# EAGLE design HIVDC_v1p1 (EAGLE 9.6.2)
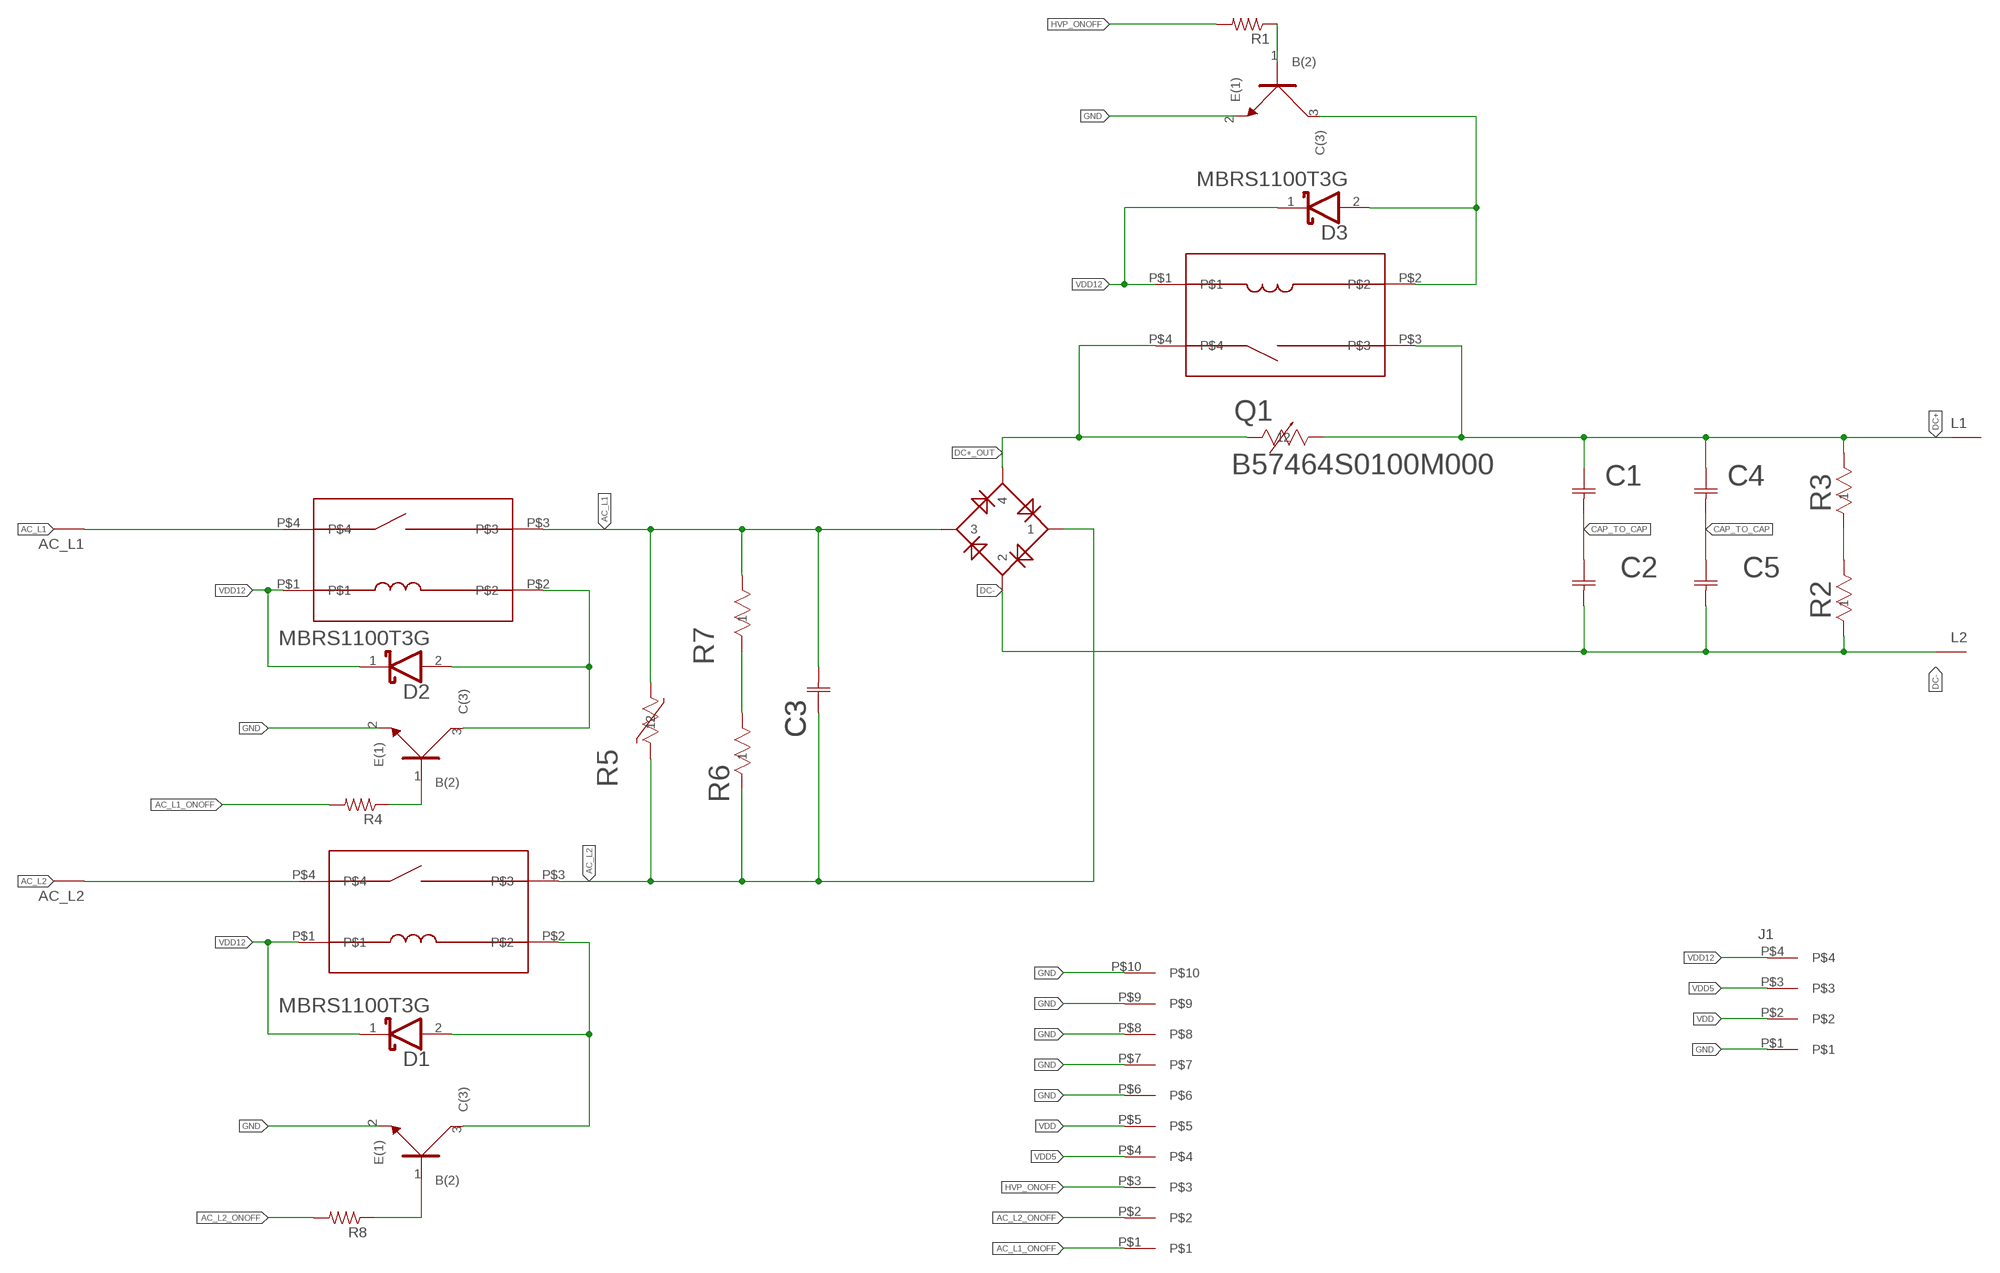
[diagram p0: schematic, sheet 1]

## Parts
AC_L1  AC_240V_N_15A  [AC_240V_L1_15A]
AC_L2  AC_240V_L_15A  [AC_240V_L1_15A]
C1  SLP152M250H9P3  [CAP_SLP152M250H9P3_CND]
C2  SLP152M250H9P3  [CAP_SLP152M250H9P3_CND]
C3  B32922C3104K  [CAP_5.0_X_10.5_X_18.0_EPC]
C4  SLP152M250H9P3  [CAP_SLP152M250H9P3_CND]
C5  SLP152M250H9P3  [CAP_SLP152M250H9P3_CND]
D1  MBRS1100T3GON_SEMI_MBRS1100T3G_0_0  [SMB]
D2  MBRS1100T3GON_SEMI_MBRS1100T3G_0_0  [SMB]
D3  MBRS1100T3GON_SEMI_MBRS1100T3G_0_0  [SMB]
J1  4-pos  3.81MM_1_X_4_RT_ANGLE_PLUG_HEADER  [1X4_3.81MM_PITCH]
L1  DC_HI_V  [AC_240V_L1_15A]
L2  DC_HI_V  [AC_240V_L1_15A]
Q1  B57464S0100M000  [TRES_B57464S0XXXM000_EPC]
R1  R_0402  [0402]
R2  CRCW1206220KJNEAHPRES_V1206_VIS-M  [RES_V1206_VIS-M]
R3  CRCW1206220KJNEAHPRES_V1206_VIS-M  [RES_V1206_VIS-M]
R4  R_0402  [0402]
R5  VDRUS10T510BSE  [VRES_VDRUS10T460BSE_VIS]
R6  CRCW1206220KJNEAHPRES_V1206_VIS-M  [RES_V1206_VIS-M]
R7  CRCW1206220KJNEAHPRES_V1206_VIS-M  [RES_V1206_VIS-M]
R8  R_0402  [0402]
RL1  J120D1AS12VDCP  [J120D]
RL2  J120D1AS12VDCP  [J120D]
RL3  J120D1AS12VDCP  [J120D]
U1  NPN  BC846BW  [SOT323]
U2  NPN  BC846BW  [SOT323]
U3  NPN  BC846BW  [SOT323]
U$1  KBPC5010W-G  [KBPC-W_THRU]
U$3  1_X_10_HEADER_GENERIC_.1INCH  [HEADER_1_X_10_.1_INCH]

## Nets
AC_L1: AC_L1.P$1 C3.2 R5.1 R7.2 RL2.P$3 RL2.P$4 U$1.3
AC_L1_ONOFF: R4.P$2 U$3.P$1
AC_L2: AC_L2.P$1 C3.1 R5.2 R6.1 RL3.P$3 RL3.P$4 U$1.1
AC_L2_ONOFF: R8.P$2 U$3.P$2
CAP_TO_CAP: C1.2 C2.1 C4.2 C5.1
DC+: C1.1 C4.1 L1.P$1 Q1.1 R3.2 RL1.P$3
DC+_OUT: Q1.2 RL1.P$4 U$1.4
DC-: C2.2 C5.2 L2.P$1 R2.1 U$1.2
GND: J1.P$1 U1.2(E(1)) U2.2(E(1)) U3.2(E(1)) U$3.P$6 U$3.P$7 U$3.P$8 U$3.P$9 U$3.P$10
HVP_ONOFF: R1.P$2 U$3.P$3
N$2: D3.2(ANODE) RL1.P$2 U1.3(C(3))
N$4: R6.2 R7.1
N$5: R2.2 R3.1
N$6: R1.P$1 U1.1(B(2))
N$9: D2.2(ANODE) RL2.P$2 U2.3(C(3))
N$10: R4.P$1 U2.1(B(2))
N$12: D1.2(ANODE) RL3.P$2 U3.3(C(3))
N$14: R8.P$1 U3.1(B(2))
VDD: J1.P$2 U$3.P$5
VDD5: J1.P$3 U$3.P$4
VDD12: D1.1(CATHODE) D2.1(CATHODE) D3.1(CATHODE) J1.P$4 RL1.P$1 RL2.P$1 RL3.P$1

## Library data of the parts
AC_L1 = 3D_MIG_Controller:AC_240V_N_15A
AC_L2 = 3D_MIG_Controller:AC_240V_L_15A
C1 C2 C4 C5 = 3D_MIG_Controller:SLP152M250H9P3; BUILT_BY: EMA_Kyle; COPYRIGHT: Copyright (C) 2018 Accelerated Designs. All rights reserved; DATASHEET: https://www.cde.com/resources/catalogs/SLP.pdf; MANUFACTURER_PART_NUMBER: SLP152M250H9P3; SOURCELIBRARY: Add_to_database_2021-04-21; VENDOR: Cornell Dubilier
C3 = 3D_MIG_Controller:B32922C3104K; BUILT_BY: EMA_UL_Team; MANUFACTURER_PART_NUMBER: B32922C3104K; SOURCELIBRARY: Epcos_2012-08-08; VENDOR: Epcos
D1-D3 = 3D_MIG_Controller:MBRS1100T3G: Diode Schottky 100V 1A Surface Mount; 3DS_PART_NUMBER: 417-00000; CENTROID_NOT_SPECIFIED: No; DATASHEET: http://www.onsemi.com/pub/Collateral/MBRS1100T3-D.PDF; DC_BLOCKING_VOLTAGE: 100V; DEVICE_CLASS_L1: Discrete Semiconductors; DEVICE_CLASS_L2: Diodes; DEVICE_CLASS_L3: Schottky Diodes; DIGIKEY_DESCRIPTION: DIODE SCHOTTKY 100V 1A SMB; DIGIKEY_PART_NUMBER: MBRS1100T3GOSCT-ND; FOOTPRINT_URL: http://www.onsemi.cn/PowerSolutions/document/403A-03.PDF; FOOTPRINT_VARIANT_NAME_0: Recommended_Land_Pattern; FORWARD_CURRENT: 2A; HEIGHT: 2.47mm; LEAD_FREE: yes; MAX_JUNCTION_TEMP: +175°C; MAX_REPETITIVE_REVERSE_VOLTAGE: 100V; MF: ON Semi; MFG_PACKAGE_IDENT: 403A-03; MFG_PACKAGE_IDENT_DATE: 07/2012; MFG_PACKAGE_IDENT_REV: J; MOUSER_DESCRIPTION: Schottky Diodes & Rectifiers 1A 100V; MOUSER_PART_NUMBER: 863-MBRS1100T3G; MPN: MBRS1100T3G; PACKAGE: SMB; PREFIX: D; ROHS: yes; STANDOFF_HEIGHT: 0.05mm; TEMPERATURE_RANGE_HIGH: +175°C; TEMPERATURE_RANGE_LOW: -65°C; VERIFICATION_VERSION: 0.0.0.1; WORKING_REVERSE_VOLTAGE: 100V
J1 = 3D_MIG_Controller:3.81MM_1_X_4_RT_ANGLE_PLUG_HEADER: 4 Position Terminal Block Header, Male Pins, Shrouded (4 Side) 0.150" (3.81mm) 90°, Right Angle - Through Hole; PARTNO: 691322310004
L1 L2 = 3D_MIG_Controller:DC_HI_V
Q1 = 3D_MIG_Controller:B57464S0100M000; BUILT_BY: EMA_Cory; COPYRIGHT: Copyright (C) 2018 Accelerated Designs. All rights reserved; DATASHEET: https://product.tdk.com/info/en/documents/data_sheet/50/db/icl_16/S464.pdf; MANUFACTURER_PART_NUMBER: B57464S0100M000; SOURCELIBRARY: Add_to_database_2020-12-11; VENDOR: Epcos
R1 R4 R8 = 3D_MIG_Controller:R_0402
R2 R3 R6 R7 = 3D_MIG_Controller:CRCW1206220KJNEAHP; BUILT_BY: EMA_UL_Team; MANUFACTURER_PART_NUMBER: CRCW1206220KJNEAHP; SOURCELIBRARY: Vishay_2015_05_22; VENDOR: Vishay
R5 = 3D_MIG_Controller:VDRUS10T510BSE; BUILT_BY: EMA_Cory; COPYRIGHT: Copyright (C) 2018 Accelerated Designs. All rights reserved; DATASHEET: https://www.vishay.com/docs/29185/vdrus.pdf; MANUFACTURER_PART_NUMBER: VDRUS10T510BSE; SOURCELIBRARY: Vishay_2020-08-10; VENDOR: Vishay
RL1-RL3 = 3D_MIG_Controller:J120D1AS12VDCP
U1-U3 = 3D_MIG_Controller:BC846BW: Bipolar (BJT) Transistor NPN 100MHz Surface Mount SOT-323; PARTNO: BC846BW_NPN
U$1 = 3D_MIG_Controller:KBPC5010W-G
U$3 = 3D_MIG_Controller:1_X_10_HEADER_GENERIC_.1INCH

## Board
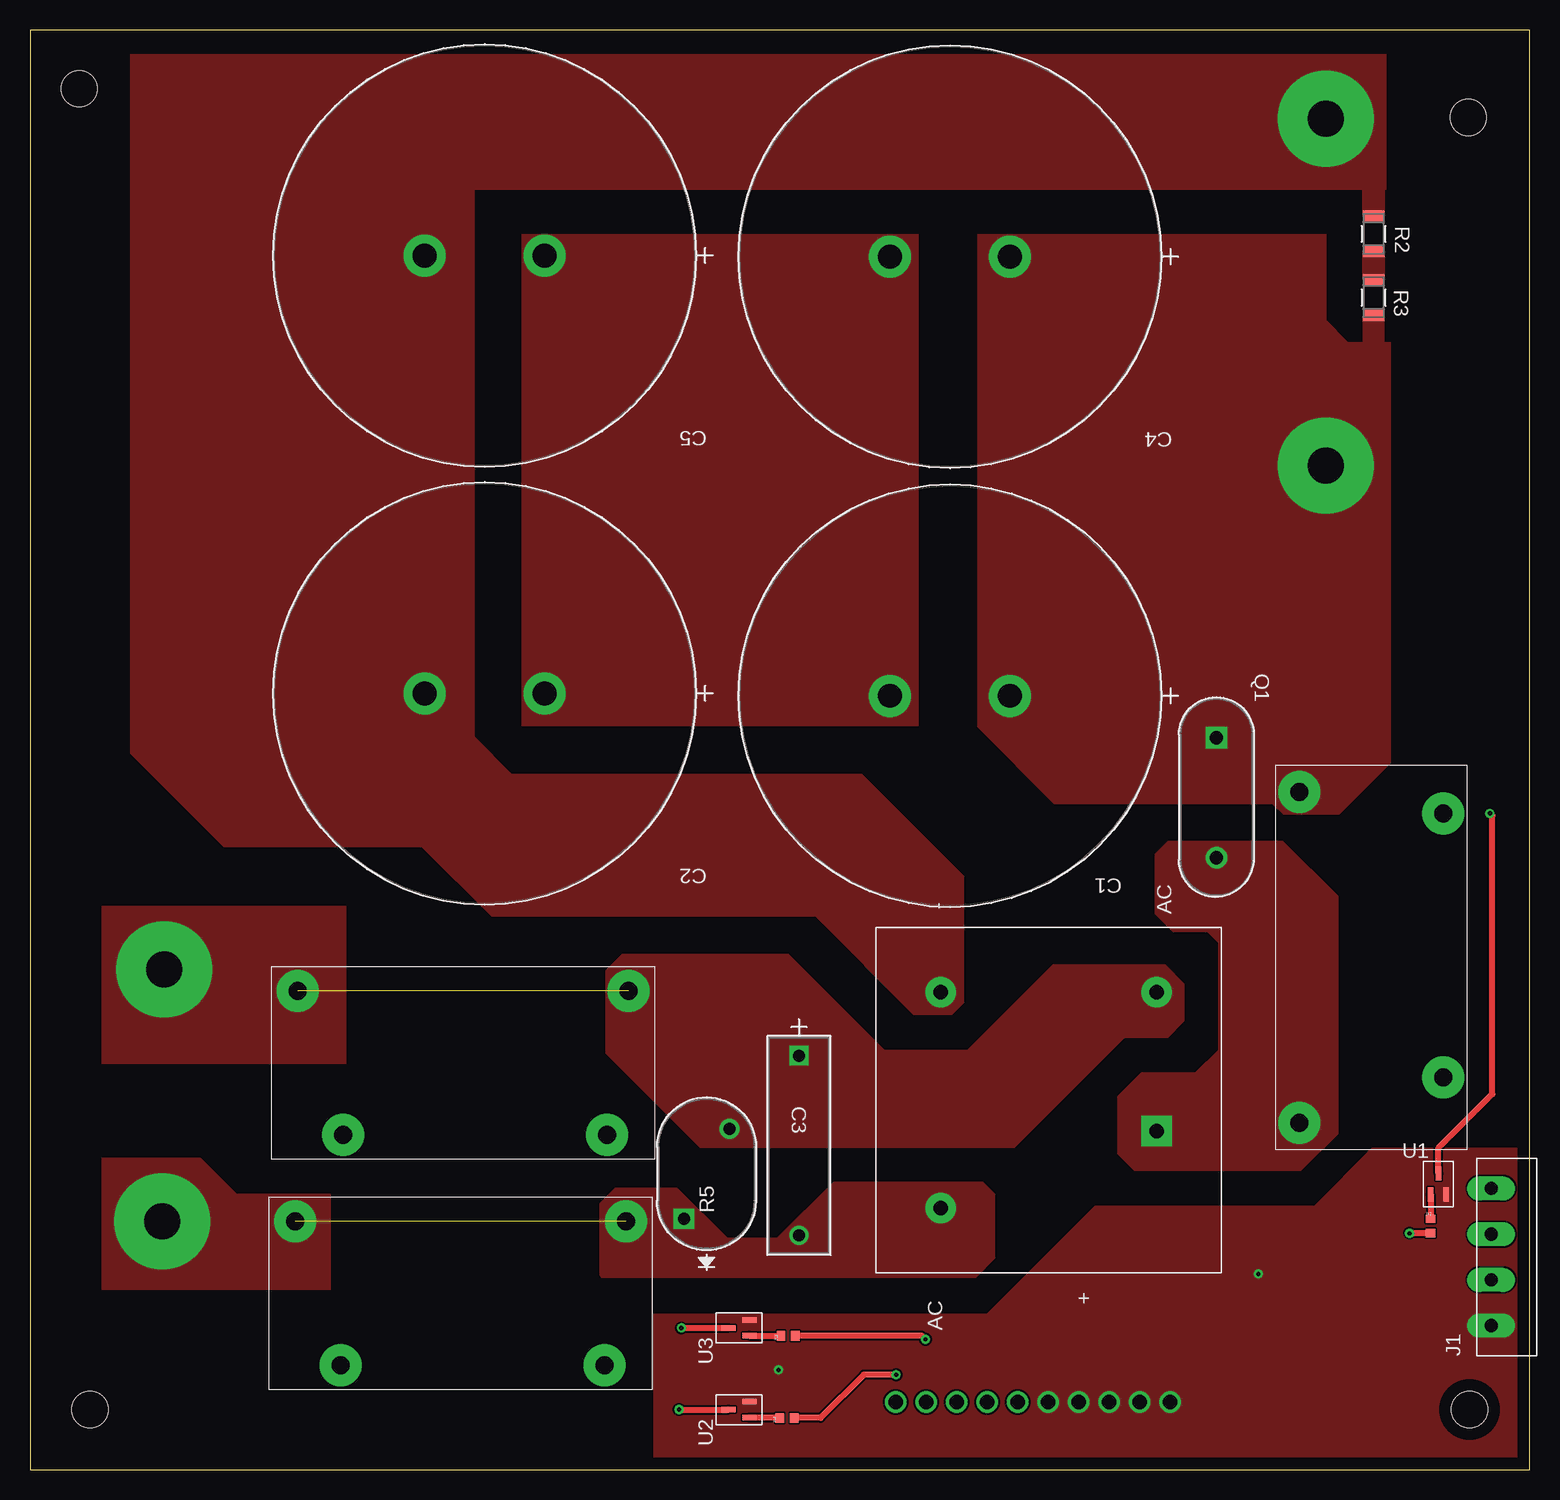
[diagram p1: board, top side]
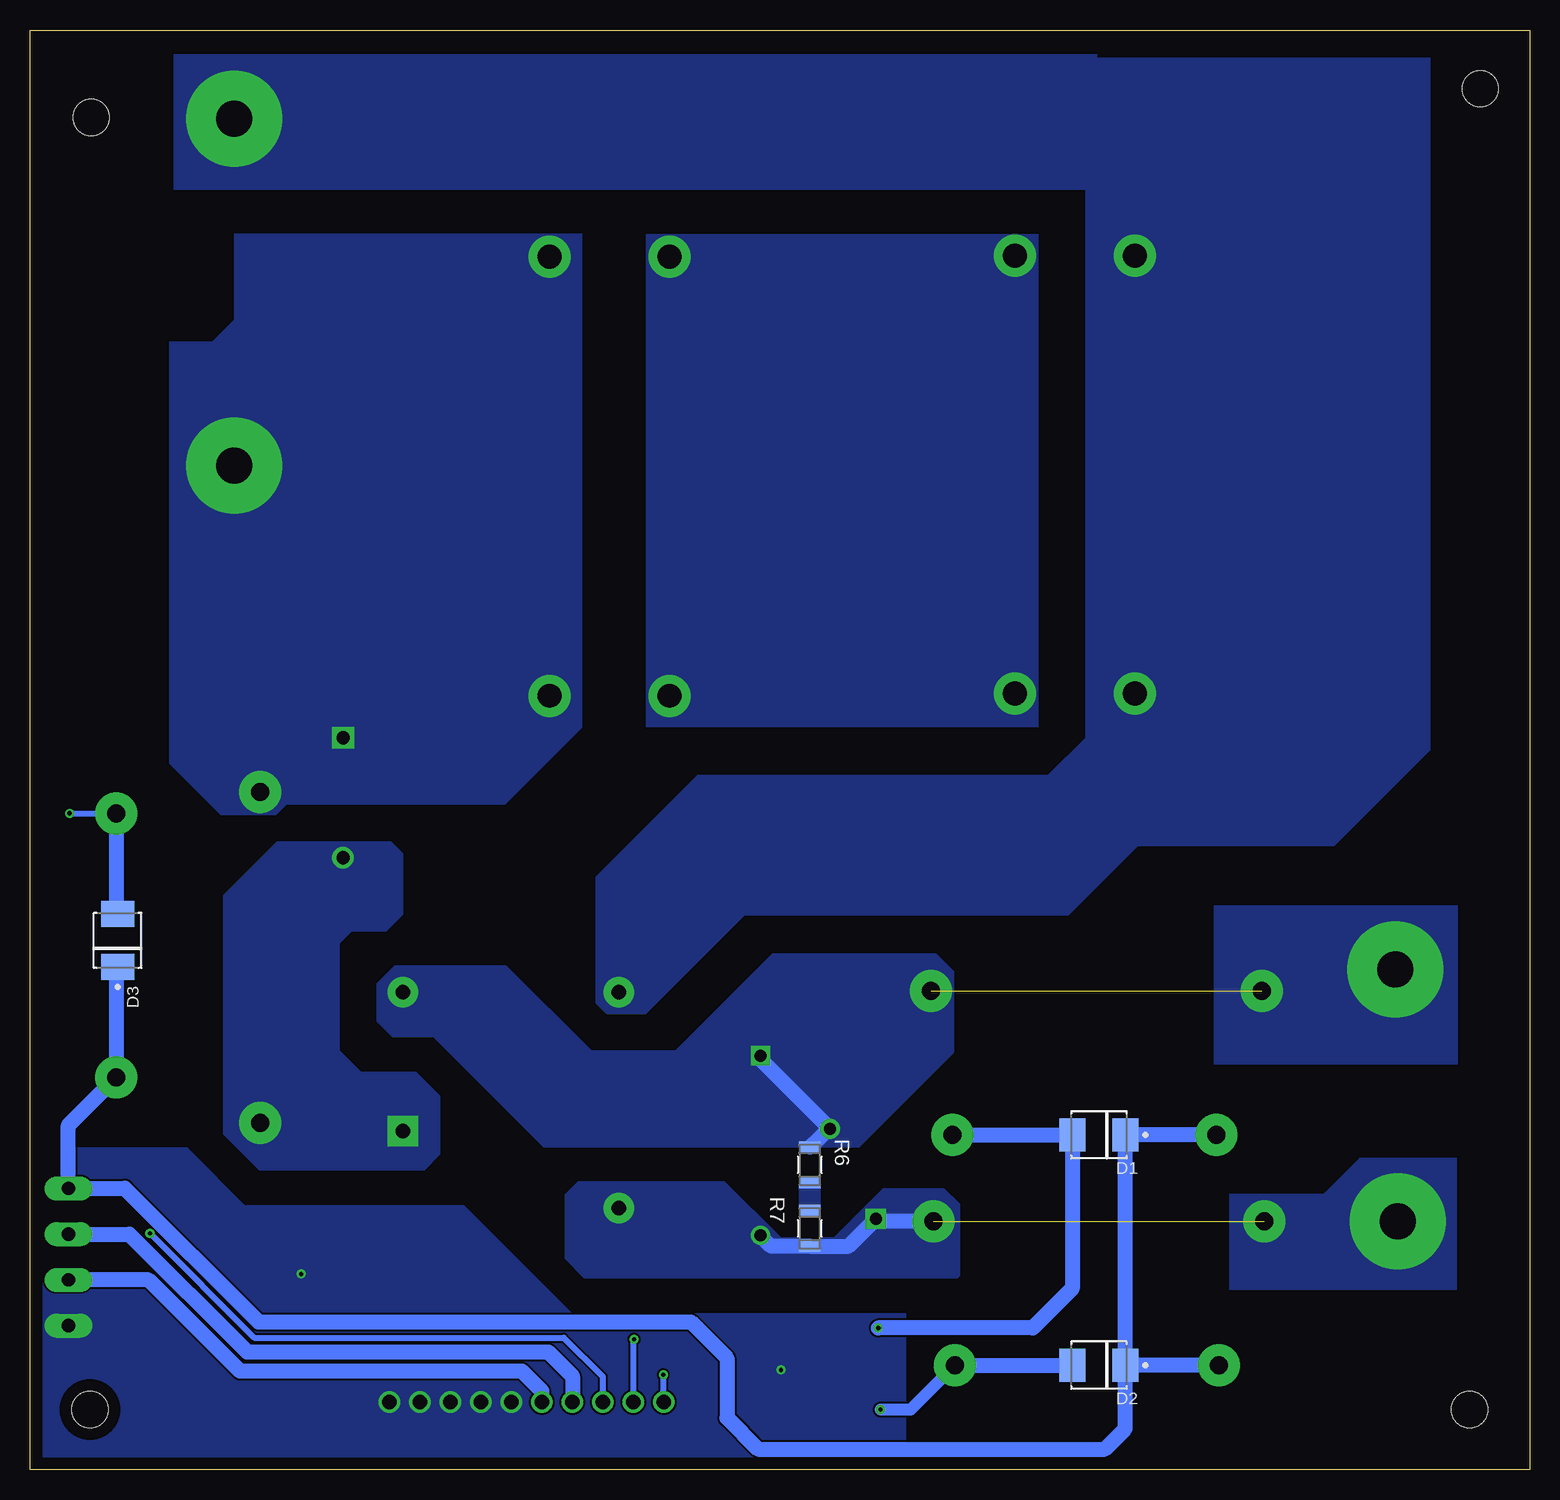
[diagram p2: board, bottom side, seen from below]

Size 125 x 120 mm. Coordinates in mm from the lower left corner, seen from the top.
Outline: 0,0 125,0 125,120 0,120 0,0
Copper layers (1*16): Top 0.035mm / dielectric 1.5mm / Bottom 0.035mm
Design rules "default": minimum track width 6mil, minimum drill 0.35mm, track to track 6mil, track to pad 6mil, pad to pad 6mil, via to via 6mil, smd to smd 6mil, copper to edge 40mil, drill to drill 6mil, minimum pad ring 10mil, minimum via ring 8mil, stop-mask expansion 4mil, vias tented up to drill 0mil, thermal gap 10mil
Holes 3 mm at 5,5 120,5 119.9,112.7 4.1,115.1

### Footprints (pad centres in the part's own frame; a part is rotated, then mirrored left to right if it is on the bottom)
AC_240V_L1_15A = drill 3 pad 8: P$1 0,0
CAP_SLP152M250H9P3_CND = drill 1.999 pad 3.5: 1 0,0; 2 10.008,0
CAP_5.0_X_10.5_X_18.0_EPC = drill 1 pad 1.6 square: 1 0,0 | drill 1 pad 1.6: 2 14.986,0
SMB = smd 2.159 x 2.743: 1 -2.21,0; 2 2.21,0
1X4_3.81MM_PITCH = drill 1.1 pad 2 long: P$1 0,0; P$2 3.81,0; P$3 7.62,0; P$4 11.43,0
TRES_B57464S0XXXM000_EPC = drill 1.1 pad 1.8 square: 1 0,0 | drill 1.1 pad 1.8: 2 10,0
0402 = smd 0.8 x 0.7: P$1 0,0.6; P$2 0,-0.6
RES_V1206_VIS-M = smd 0.955 x 1.801: 1 -1.477,0; 2 1.477,0
VRES_VDRUS10T460BSE_VIS = drill 1 pad 1.7 square: 1 0,0 | drill 1 pad 1.7: 2 7.493,-3.81
J120D = drill 1.5 pad 3.5: P$1 -10,-6; P$2 12,-6; P$3 13.8,6; P$4 -13.8,6
SOT323 = smd 0.457 x 1.168: 1 -0.65,-0.876; 2 0.65,-0.876; 3 0,0.876
KBPC-W_THRU = drill 1.2 pad 2.54: 1 -9,9; 2 -9,-9; 3 9,-9 | drill 1.2 pad 2.54 square: 4 2.6,9
HEADER_1_X_10_.1_INCH = drill 1.2 pad 1.6: P$1 -24.13,-1.27; P$2 -21.59,-1.27; P$3 -19.05,-1.27; P$4 -16.51,-1.27; P$5 -13.97,-1.27; P$6 -11.43,-1.27; P$7 -8.89,-1.27; P$8 -6.35,-1.27; P$9 -3.81,-1.27; P$10 -1.27,-1.27

### Placement (x,y rotation side)
AC_L1  11,20.7 0 top
AC_L2  11.2,41.7 0 top
C1  81.7,64.5 180 top
C2  42.9,64.7 180 top
C3  64.1,34.5 270 top
C4  81.7,101.1 180 top
C5  42.9,101.2 180 top
D1  35.9,27.9 180 bottom
D2  35.9,8.7 180 bottom
D3  117.7,44.1 90 bottom
J1  121.8,12 90 top
L1  108,83.7 0 top
L2  108,112.6 0 top
Q1  98.9,61 270 top
R1  116.75,20.3 0 top
R2  112,103 270 top
R3  112,97.7 270 top
R4  63.1,4.3 90 top
R5  54.5,20.9 90 top
R6  60,25.4 270 bottom
R7  60,20.1 270 bottom
R8  63.2,11.15 90 top
RL1  111.8,42.7 90 top
RL2  35.9,14.7 0 top
RL3  36.1,33.9 0 top
U1  117.4,23.8 0 top
U2  59.1,5 90 top
U3  59.1,11.8 90 top
U$1  84.9,30.8 270 top
U$3  96.3,6.9 0 top

### Tracks (layer width: path | path; a pad name or v marks a point on that pad's centre or on a via)
AC_L1  (1 unrouted)
  Bottom 1.27: C3.2 63.21,18.62 R7.2 56.78,18.62 R5.1 54.3,20.7 RL2.P$3
  pour Bottom (no thermals): 6.1,15 25,15 25,22.9 25,23 17.1,23 14.1,26 8.1,26 6.1,26
  pour Bottom (no thermals): 67.1,24 79.3,24 80.4,22.9 80.4,17.6 78.8,16 47.7,16 47.5,16.2 47.5,22.1 48.8,23.4 53.9,23.4 58,19.3 62.4,19.3
  pour Top (no thermals): 17.2,23 25,23 25,15 6,15 6,26 14.2,26
  pour Top (no thermals): 47.5,16.2 47.5,22.2 48.8,23.5 53.9,23.5 58.1,19.3 62.3,19.3 67,24 79.4,24 80.4,23 80.4,17.6 78.8,16 47.7,16
AC_L1_ONOFF  (via drill 0.35)
  Top 0.508: v72.2,7.9 69.5,7.9 65.9,4.3 R4.P$2
  Bottom 0.508: v72.2,7.9 72.17,7.87 U$3.P$1
AC_L2  (1 unrouted)
  Bottom 1.27: C3.1 64.1,34.18 R5.2 58.38,28.39 R6.1
  pour Bottom (no thermals): 6,47 26.3,47 26.3,33.8 6,33.8
  pour Bottom (no thermals): 48,34.8 48,41.5 49.5,43 63.1,43 71.2,34.9 78.2,34.9 85.3,42 94.6,42 96.1,40.5 96.1,37.4 94.8,36.1 91.4,36.1 82.2,26.9 55.9,26.9
  pour Top (no thermals): 48,41.6 49.4,43 63.2,43 71.2,35 78.2,35 85.3,42.1 94.6,42.1 96.2,40.5 96.2,37.4 94.8,36 91.2,36 82,26.8 55.9,26.8 48,34.7
  pour Top (no thermals): 6,47 26.3,47 26.3,33.8 6,33.8
AC_L2_ONOFF  (via drill 0.35)
  Top 0.508: v74.65,10.85 74.35,11.15 R8.P$2
  Bottom 0.508: U$3.P$2 74.71,10.79 v74.65,10.85
CAP_TO_CAP
  pour Bottom (no thermals): 41,103 41,61.9 73.6,61.9 73.6,103
  pour Top (no thermals): 41,103 74,103 74,62 41,62
DC+
  pour Bottom (no thermals): 79,103 108,103 108,95.8 109.8,94 113.4,94 113.4,58.9 109.1,54.6 104.5,54.6 103.6,55.5 85.4,55.5 79,61.9
  pour Top (no thermals): 79,61.9 79,103 108,103 108,95.8 109.8,94 113.4,94 113.4,58.9 109.1,54.6 104.5,54.6 103.6,55.5 85.4,55.5
  pour Top (no thermals): 112.9,96.2 111.1,96.2 111.1,93.1 112.9,93.1
DC+_OUT
  pour Bottom (no thermals): 90.8,31.1 92.8,33.1 97.4,33.1 99.2,34.9 99.2,43.9 98.2,44.9 95.3,44.9 93.9,46.3 93.9,51.3 94.9,52.3 104.4,52.3 108.9,47.8 108.9,28 105.9,25 92.1,25 90.8,26.3
  pour Top (no thermals): 90.7,26.3 90.7,31.1 92.7,33.1 97.2,33.1 99.1,35 99.1,43.9 98.2,44.8 95.3,44.8 93.8,46.3 93.8,51.3 94.9,52.4 104.4,52.4 109,47.8 109,28 105.9,24.9 92.1,24.9
DC-
  pour Bottom (no thermals): 16.3,52 32.7,52 38.5,46.2 65.5,46.2 73.7,38 76.9,38 77.8,38.9 77.8,49.4 69.3,57.9 40.1,57.9 37,61 37,117.7 8.3,117.7 8.3,60
  pour Bottom (no thermals): 36.1,118 36.1,106.7 113,106.7 113,118
  pour Top (no thermals): 8.4,118 113,118 113,106.7 37,106.7 37,61.1 40.1,58 69.3,58 77.8,49.5 77.8,38.9 76.8,37.9 73.7,37.9 65.5,46.1 38.5,46.1 32.7,51.9 16.2,51.9 8.4,59.7
  pour Top (no thermals): 112.9,104.5 111.1,104.5 111.1,107.2 112.9,107.2
GND  (via drill 0.35)
  other vias: 62.4,8.3 102.4,16.3
  pour Top (no thermals): 52,13 79.8,13 88.8,22 107.1,22 111.9,26.8 125,26.8 125,0 52,0
  pour Bottom (no thermals): 52,0 52,13 79.8,13 88.8,22 107.1,22 111.9,26.8 125,26.8 125,0
HVP_ONOFF  (via drill 0.35)
  Top 0.508: R1.P$2 v115,19.7
  Bottom 0.508: U$3.P$3 77.25,7.73 80.52,11 106.3,11 v115,19.7
N$2  (via drill 0.35)
  Top 0.508: v121.7,54.7 121.9,54.5 121.9,31.3 117.4,26.8 U1.3
  Bottom 0.508: v121.7,54.7 RL1.P$2
  Bottom 1.27: RL1.P$2 117.8,46.41 D3.2
N$4
  pour Bottom (no thermals): 59.1,24.4 60.9,24.4 60.9,21.1 59.1,21.1
N$5
  pour Top (no thermals): 111.1,101.6 112.9,101.6 112.9,99.2 111.1,99.2
N$6
  Top 0.508: U1.1 R1.P$1
N$9  (via drill 0.35)
  Top 0.508: v54.1,5 U2.3
  Bottom 1.016: RL2.P$2 51.6,5 v54.1,5
  Bottom 1.27: RL2.P$2 D2.2
N$10
  Top 0.508: U2.1 62.45,4.35 R4.P$1
N$12  (via drill 0.35)
  Top 0.508: v54.3,11.8 U3.3
  Bottom 1.27: RL3.P$2 D1.2 38.11,15.09 41.4,11.8 v54.3,11.8
N$14
  Top 0.508: U3.1 R8.P$1
VDD
  Bottom 1.27: U$3.P$5 82.33,6.53 84,8.2 107.5,8.2 115.11,15.81 J1.P$2
VDD5
  Bottom 1.27: J1.P$3 116.72,19.62 106.9,9.8 81.8,9.8 79.79,7.79 U$3.P$4
VDD12
  Bottom 1.27: RL2.P$1 D2.1 | RL3.P$1 D1.1 D2.1 | D2.1 33.69,3.41 35.4,1.7 64.3,1.7 66.9,4.3 66.9,9.3 69.9,12.3 105.95,12.3 117.09,23.44 121.79,23.44 J1.P$4 121.8,28.7 RL1.P$1 117.8,41.79 D3.1